# Altium schematic sheet Pilot_Line.SchDoc
size A4; CompanyName: Technische Hochschule Nürnberg Georg Simon Ohm; Organization: UltraZohm; Address1: Kesslerplatz 12; Address2: 90489 Nürnberg; Address3: GERMANY; SheetNumber: 12; SheetTotal: 36; Website: www.ultrazohm.com
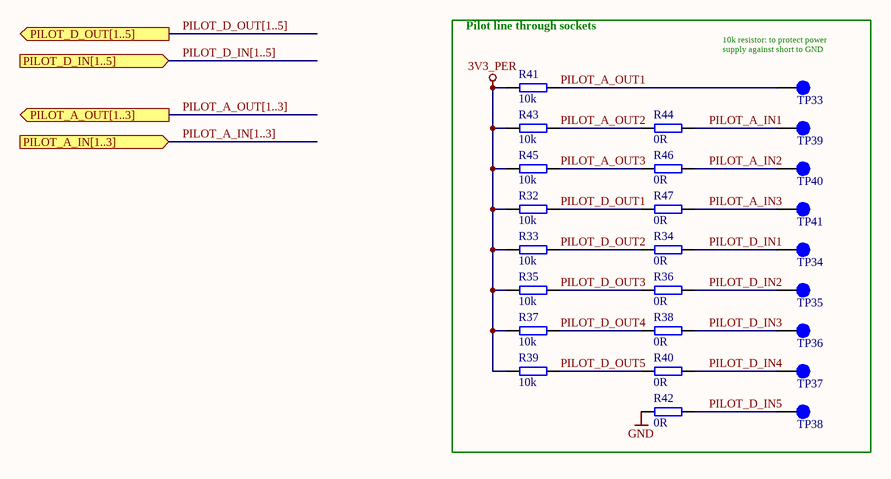
[diagram p0: Pilot_Line.SchDoc]

## Parts
R32  10k  [R_0603_TE]
R33  10k  [R_0603_TE]
R34  0R  [R_0603_TE]
R35  10k  [R_0603_TE]
R36  0R  [R_0603_TE]
R37  10k  [R_0603_TE]
R38  0R  [R_0603_TE]
R39  10k  [R_0603_TE]
R40  0R  [R_0603_TE]
R41  10k  [R_0603_TE]
R42  0R  [R_0603_TE]
R43  10k  [R_0603_TE]
R44  0R  [R_0603_TE]
R45  10k  [R_0603_TE]
R46  0R  [R_0603_TE]
R47  0R  [R_0603_TE]
TP33  Testpoint 1mm  [TP_1mm]  (value not drawn)
TP34  Testpoint 1mm  [TP_1mm]  (value not drawn)
TP35  Testpoint 1mm  [TP_1mm]  (value not drawn)
TP36  Testpoint 1mm  [TP_1mm]  (value not drawn)
TP37  Testpoint 1mm  [TP_1mm]  (value not drawn)
TP38  Testpoint 1mm  [TP_1mm]  (value not drawn)
TP39  Testpoint 1mm  [TP_1mm]  (value not drawn)
TP40  Testpoint 1mm  [TP_1mm]  (value not drawn)
TP41  Testpoint 1mm  [TP_1mm]  (value not drawn)

## Blocks framed on the sheet
Pilot line through sockets: R32-R47 TP33-TP41

## Ports
PILOT_A_IN[1..3] (in), PILOT_A_OUT[1..3] (out), PILOT_D_IN[1..5] (in), PILOT_D_OUT[1..5] (out)

## Nets
3V3_PER: R32.1 R33.1 R35.1 R37.1 R39.1 R41.1 R43.1 R45.1
GND: R42.1
PILOT_A_IN1: R44.2 TP39.1
PILOT_A_IN2: R46.2 TP40.1
PILOT_A_IN3: R47.2 TP41.1
PILOT_A_OUT1: R41.2 TP33.1
PILOT_A_OUT2: R43.2 R44.1
PILOT_A_OUT3: R45.2 R46.1
PILOT_D_IN1: R34.2 TP34.1
PILOT_D_IN2: R36.2 TP35.1
PILOT_D_IN3: R38.2 TP36.1
PILOT_D_IN4: R40.2 TP37.1
PILOT_D_IN5: R42.2 TP38.1
PILOT_D_OUT1: R32.2 R47.1
PILOT_D_OUT2: R33.2 R34.1
PILOT_D_OUT3: R35.2 R36.1
PILOT_D_OUT4: R37.2 R38.1
PILOT_D_OUT5: R39.2 R40.1

## Buses and harness runs
bus PILOT_A_IN[1..3] = port PILOT_A_IN[1..3]
bus PILOT_A_OUT[1..3] = port PILOT_A_OUT[1..3]
bus PILOT_D_IN[1..5] = port PILOT_D_IN[1..5]
bus PILOT_D_OUT[1..5] = port PILOT_D_OUT[1..5]

## Notes on the sheet
- (near TP33) 10k resistor: to protect power supply against short to GND
- Title
- Revision:
- Design Engineer:
- Date:
- Project:
- Sheet
- of

## Library data of the parts
R32 R33 R35 R37 R39 R41 R43 R45 = UZgen_R_0603_10k: Generic resistor; Manufacturer: UZgen; Tolerance: 1 %; Created from: AGeiger; Value: 10k; Manufacturer Part Number: UZgen_R_0603_10k; PartID: 1; Created On: 02.07.2024 14:34:53; Device Package: 0603; Mounting Type: SMD; Last Updated: 02.07.2024 14:37:16
R34 R36 R38 R40 R42 R44 R46 R47 = UZgen_R_0603_0R: Generic resistor; Manufacturer: UZgen; Tolerance: 1 %; Created from: UZgenTool; Value: 0R; Manufacturer Part Number: UZgen_R_0603_0R; PartID: 581; Created On: 08.07.2024 14:34:30; Device Package: 0603; Mounting Type: SMD; Last Updated: 08.07.2024 14:34:30
TP33-TP41 = 25063: AN: 25063; Mixed: SMT